# Altium schematic sheet HFM_SWD.SchDoc
size A4
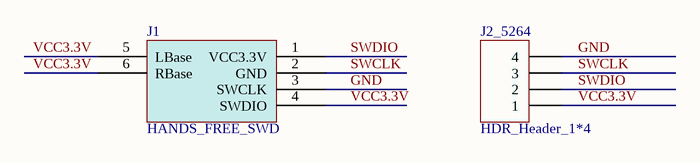
[diagram p0: HFM_SWD.SchDoc]

## Parts
J1  HANDS_FREE_SWD  [HDR_Molex_PH_1.25_4P]
J2_5264  HDR_Header_1*4  [HDR_MOLEX_5264_DH_4P]

## Nets
GND: J1.3(SWCLK) J2_5264.4
SWCLK: J1.2(GND) J2_5264.3
SWDIO: J1.1(VCC3.3V) J2_5264.2
VCC3.3V: J1.4(SWDIO) J1.5(LBase) J1.6(RBase) J2_5264.1

## Library data of the parts
J1 = HANDS_FREE_SWD: 卧贴 molex 1.25间距 4P接口
J2_5264 = HDR_Header_1*4: LatestRevisionDate: 17-Jul-2002; LatestRevisionNote: Re-released for DXP Platform.; Publisher: Altium Limited